# Altium project Lab1_Kondrashova_USB_RS485.PrjPcb
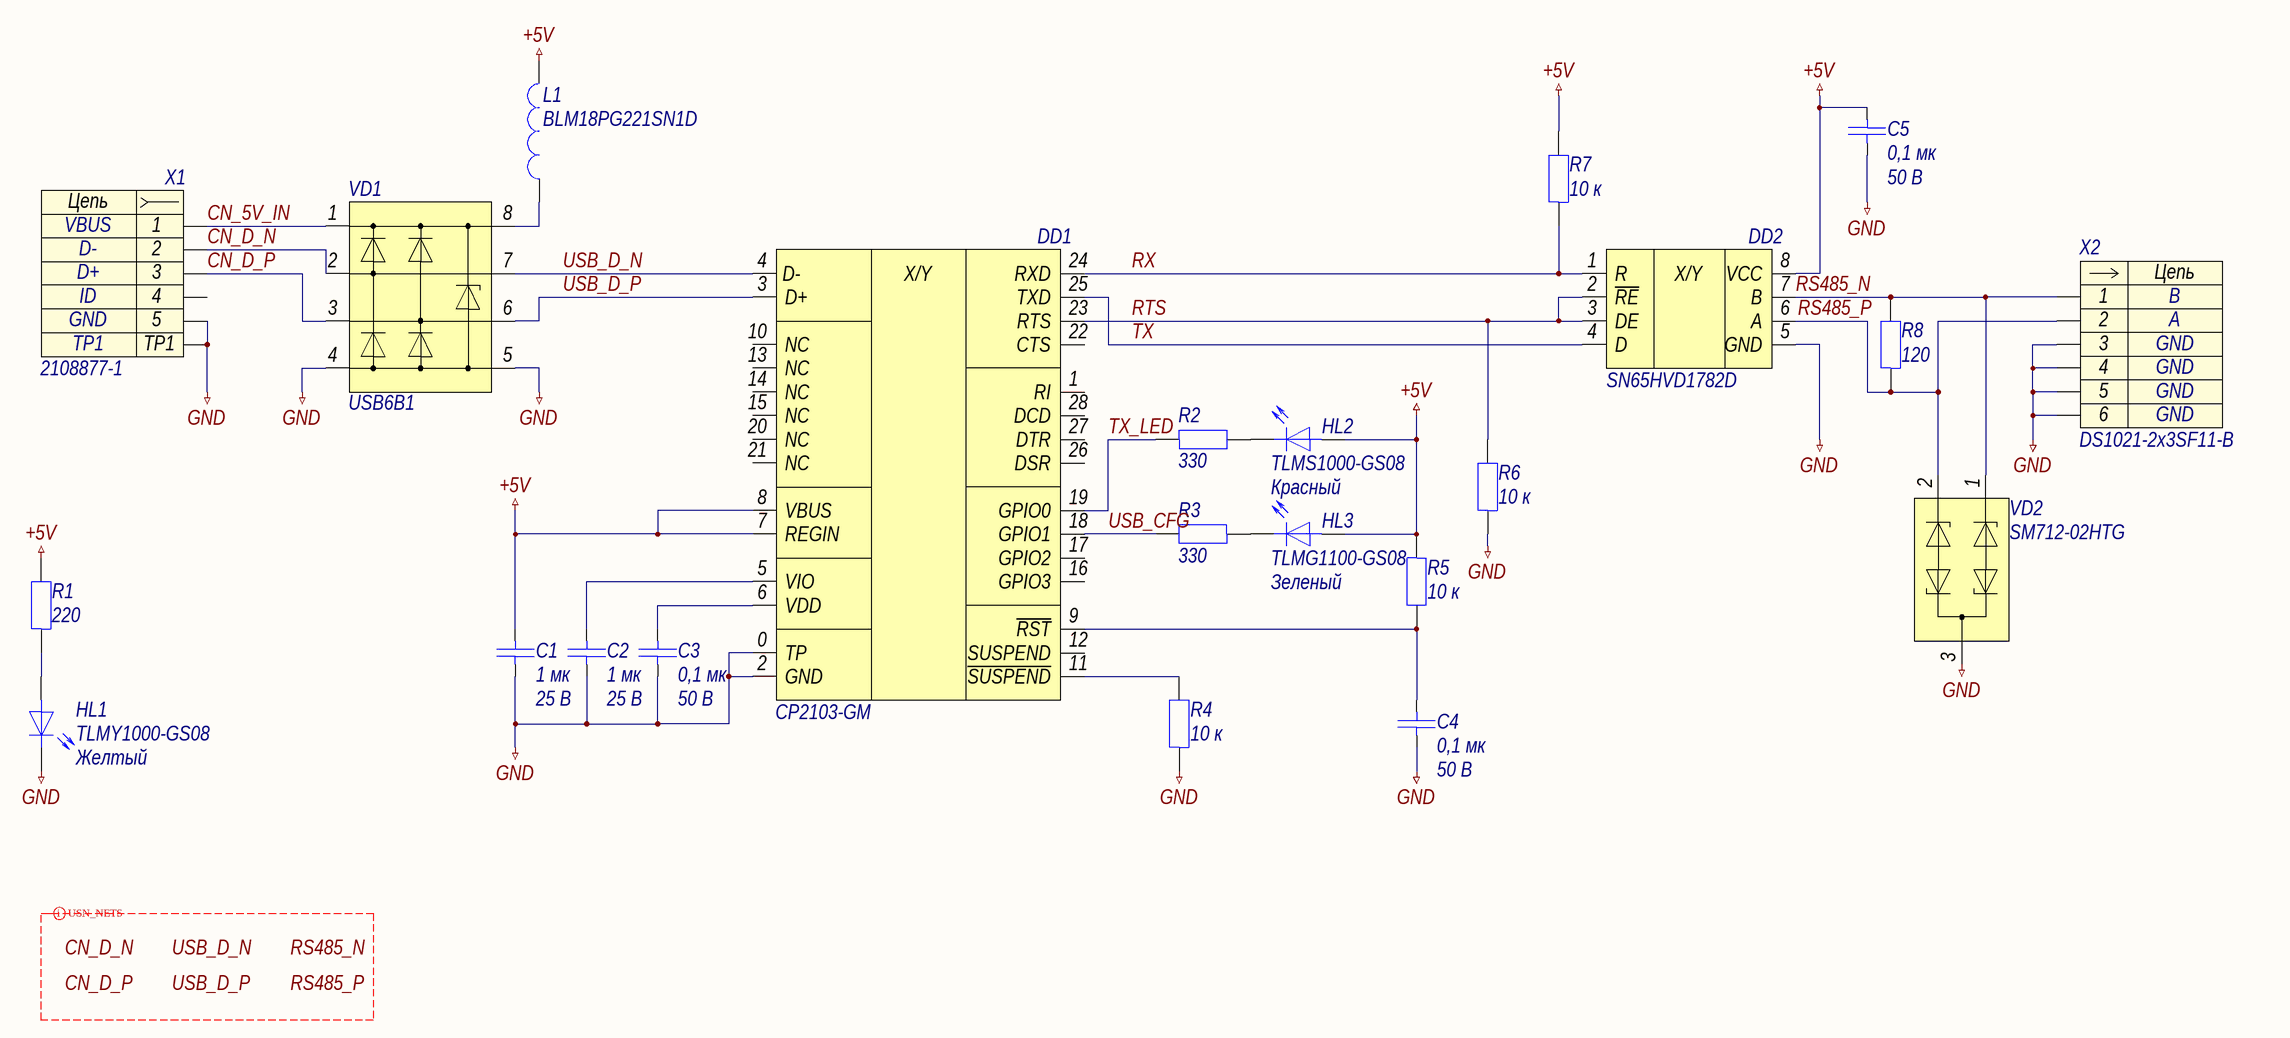
[diagram p0: Lab1_Kondrashova_USB_RS485.SchDoc]
approver: Капустин; check: Капустин; designation: СПбПУ.3331506.012; developer: Кондрашова; document_code: Ý3; document_type: Схема электрическая принципиальная; pcb_dec_number: СПбПУ.3331506.012; project: Лабораторная работа 1; sheets_total: 1; title: Преобразователь интерфейсов; title_line_1: Преобразователь; title_line_2: USB-RS485
1 sheet, 23 parts. Net scope: global (net labels, ports and power ports of the same name join across sheets).
Board file: Lab1_Kondrashova_USB_RS485.PcbDoc

## Sheet Lab1_Kondrashova_USB_RS485.SchDoc: Преобразователь интерфейсов
size 594 x 420 mm; ApprovedBy: Капустин; CheckedBy: Капустин; DrawnBy: Кондрашова; DocumentNumber: СПбПУ.3331506.012Ý3; SheetNumber: 1; SheetTotal: 1; DocumentCode: Ý3; ImagePath: СПбПУ.3331506.012

### Parts
C1  1 мк  Напряжение: 25 В  [C0603]
C2  1 мк  Напряжение: 25 В  [C0603]
C3  0,1 мк  Напряжение: 50 В  [C0603]
C4  0,1 мк  Напряжение: 50 В  [C0603]
C5  0,1 мк  Напряжение: 50 В  [C0603]
DD1  CP2103-GM  [QFN-28-500X500X90]
DD2  SN65HVD1782D  [SOIC-8]
HL1  TLMY1000-GS08  Colour: Желтый  [HL0603]
HL2  TLMS1000-GS08  Colour: Красный  [HL0603]
HL3  TLMG1100-GS08  Colour: Зеленый  [HL0603]
L1  BLM18PG221SN1D  [BLM-2-0603]
R1  220  [R0603]
R2  330  [R0603]
R3  330  [R0603]
R4  10 к  [R0603]
R5  10 к  [R0603]
R6  10 к  [R0603]
R7  10 к  [R0603]
R8  120  [R0603]
VD1  USB6B1  [SO-8]
VD2  SM712-02HTG  [SOT23-3]
X1  2108877-1  [2108877-1]
X2  DS1021-2x3SF11-B  [DS1021-2X3SF11-B]

### Nets
+5V: C1.1 C5.2 DD1.7(REGIN) DD1.8(VBUS) DD2.8(VCC) HL2.2 HL3.2 L1.2 R1.2 R5.1 R7.2
GND: C1.2 C2.2 C3.2 C4.2 C5.1 DD1.0(TP) DD1.2(GND) DD2.5(GND) HL1.1 R4.1 R6.1 VD1.4 VD1.5 VD2.3 X1.5 X1.TP1 X2.3 X2.4 X2.5 X2.6
CN_5V_IN: VD1.1 X1.1
CN_D_N: VD1.2 X1.2
CN_D_P: VD1.3 X1.3
RS485_N: DD2.7(B) R8.2 VD2.1 X2.1
RS485_P: DD2.6(A) R8.1 VD2.2 X2.2
RTS: DD1.23(RTS) DD2.2(~{RE}) DD2.3(DE) R6.2
RX: DD1.24(RXD) DD2.1(R) R7.1
TX: DD1.25(TXD) DD2.4(D)
TX_LED: DD1.19(GPIO0) R2.1
USB_CFG: DD1.18(GPIO1) R3.2
USB_D_N: DD1.4(D-) VD1.7
USB_D_P: DD1.3(D+) VD1.6
NetC2_1: C2.1 DD1.5(VIO)
NetC3_1: C3.1 DD1.6(VDD)
NetC4_1: C4.1 DD1.9(~{RST}) R5.2
NetDD1_11: DD1.11(~{SUSPEND}) R4.2
NetHL1_2: HL1.2 R1.1
NetHL2_1: HL2.1 R2.2
NetHL3_1: HL3.1 R3.1
NetL1_1: L1.1 VD1.8

Not connected (* = marked no-connect by the designer): DD1 1(RI) 10(NC) 12(SUSPEND) 13(NC) 14(NC) 15(NC) 16(GPIO3) 17(GPIO2) 20(NC) 21(NC) 22(CTS) 26(DSR) 27(DTR) 28(DCD); X1 4

### Layout directives
differential pair; rule Differential Pairs Routing [Pref Gap = 0.15mm    Min Gap  = 0.15mm    Max Gap  = 0.15mmPref Width = 0.125mm    Min Width  = 0.125mm    Max Width  = 0.125mm]; differential pair class USB_SIGNALS: CN_D_N, CN_D_P, RS485_N, RS485_P, USB_D_N, USB_D_P

### Notes on the sheet
- Labels drawn without touching a wire or pin: CN_D_N, CN_D_P, RS485_N, RS485_P, USB_D_N, USB_D_P
- Перв. примен.
- Справ. №
- Подп. и дата
- Инв. № дубл.
- Нормоконтроль:
- Взам. инв. №
- Изм.
- Лист
- № докум.
- Подп.
- Дата
- Лит.
- Масса
- Масштаб
- Т.контр.
- Пров.
- Разраб.
- Листов
- Разработал:
- Инв. № подл.
- Н.контр.
- Утв.
- Копировал
- Формат
- А2
- (in symbol dd0004) X/Y
- (in symbol dd0014) X/Y
- (in symbol x0001) Цепь
- (in symbol x0015) Цепь

### Library data of the parts
C1 C2 = c0008: =Описание; ID: c0008; Фамилия: Ларионов; Описание: Конденсатор чип 0603 1 мкФ 25 В ±10 %; Наименование: CC0603KRX7R8BB105; Производитель: Yageo; Отклонение: ±10 %; Рабочие температуры: от -55 °С до +125 °С; Корпус: 0603; Номинал: 1 мк; Номинальное напряжение: 25 В; HelpURL: https://www.yageo.com/upload/media/product/products/datasheet/mlcc/UPY-GPHC_X7R_6.3V-to-50V_20.pdf
C3-C5 = c0005: =Описание; ID: c0005; Фамилия: Ларионов; Описание: Конденсатор чип 0603 0,1 мкФ 50 В ±5 %; Наименование: CC0603JRX7R9BB104; Производитель: Yageo; Отклонение: ±5 %; Рабочие температуры: от -55 °С до +125 °С; Корпус: 0603; Номинал: 0,1 мк; Номинальное напряжение: 50 В; HelpURL: https://www.yageo.com/upload/media/product/products/datasheet/mlcc/UPY-GPHC_X7R_6.3V-to-50V_20.pdf
DD1 = dd0004: =Описание; ID: dd0004; Фамилия: Кондрашова; Описание: Преобразователь USB-UART; Производитель: Silicon Laboratories; Корпус: QFN-28; Наименование: CP2103-GM; HelpURL: https://www.silabs.com/interface/usb-bridges/classic/device.cp2103
DD2 = dd0014: =Описание; ID: dd0014; Фамилия: Кондрашова; Описание: Приемопередатчик RS-485; Производитель: Texas Instruments; Наименование: SN65HVD1782D; Корпус: SOIC-8; HelpURL: https://www.ti.com/product/SN65HVD1782
HL1 = hl0003: =Описание; ID: hl0003; Фамилия: Ларионов; Описание: Светодиод чип 0603 желтый; Производитель: Vishay Intertechnology, Inc.; Номинальная сила света: 7,5 мкд; Номинальная длина волны: 588 нм; Номинальный прямой ток: 15 мА; Номинальное падение напряжения: 1,8 В; Рассеиваемая мощность: 40 мВт; Рабочие температуры: от –40 °С до +100 °С; Корпус: 0603; Наименование: TLMY1000-GS08; Цвет: Желтый; HelpURL: https://www.vishay.com/leds/list/product-83172/
HL2 = hl0001: =Описание; ID: hl0001; Фамилия: Ларионов; Описание: Светодиод чип 0603 красный; Производитель: Vishay Intertechnology, Inc.; Номинальная сила света: 4 мкд; Номинальная длина волны: 628 нм; Номинальный прямой ток: 15 мА; Номинальное падение напряжения: 1,8 В; Рассеиваемая мощность: 40 мВт; Рабочие температуры: от –40 °С до +100 °С; Корпус: 0603; Наименование: TLMS1000-GS08; Цвет: Красный; HelpURL: https://www.vishay.com/leds/list/product-83172/
HL3 = hl0005: =Описание; ID: hl0005; Фамилия: Ларионов; Описание: Светодиод чип 0603 зеленый; Производитель: Vishay Intertechnology, Inc.; Номинальная сила света: 35 мкд; Номинальная длина волны: 570 нм; Номинальный прямой ток: 30 мА; Номинальное падение напряжения: 2,1 В; Рассеиваемая мощность: 90 мВт; Рабочие температуры: от –40 °С до +100 °С; Корпус: 0603; Наименование: TLMG1100-GS08; Цвет: Зеленый; HelpURL: https://www.vishay.com/leds/list/product-83173/
L1 = l0002: =Описание; ID: l0002; Фамилия: Самарин; Описание: Ферритовая бусина 220 Ом ±25 %; Производитель: Murata Manufacturing Co., Ltd.; Сопротивление, 100 МГц: 220 Ом; Отклонение, 100 Мгц: ±25 %; Сопротивление при постоянном токе: 0,1 Ом; Рабочие температуры: от -55 °С до +125 °С; Корпус: 0603; Наименование: BLM18PG221SN1D; HelpURL: https://www.murata.com/en-global/products/productdetail?partno=BLM18PG221SN1%23
R1 = r0008: =Описание; ID: r0008; Фамилия: Ларионов; Описание: Резистор чип 0603 220 Ом ±1 % 0,1 Вт; Наименование: RC0603FR-07220RL; Производитель: Yageo; Отклонение: ±1 %; Номинальное напряжение: 75 В; Рабочие температуры: от -55 °С до +155 °С; Номинальный ток: 1 А; Корпус: 0603; Номинал: 220; HelpURL: https://www.yageo.com/upload/media/product/productsearch/datasheet/rchip/PYu-RC_Group_51_RoHS_L_11.pdf
R2 R3 = r0005: =Описание; ID: r0005; Фамилия: Ларионов; Описание: Резистор чип 0603 330 Ом ±1 % 0,1 Вт; Наименование: RC0603FR-07330RL; Производитель: Yageo; Отклонение: ±1 %; Номинальное напряжение: 75 В; Рабочие температуры: от -55 °С до +155 °С; Номинальный ток: 1 А; Корпус: 0603; Номинал: 330; HelpURL: https://www.yageo.com/upload/media/product/productsearch/datasheet/rchip/PYu-RC_Group_51_RoHS_L_11.pdf
R4-R7 = r0012: =Описание; ID: r0012; Фамилия: Самарин; Описание: Резистор чип 0603 10 кОм ±1 % 0,1 Вт; Наименование: RC0603FR-0710KL; Производитель: Yageo; Отклонение: ±1 %; Номинальное напряжение: 75 В; Рабочие температуры: от -55 °С до +155 °С; Номинальный ток: 1 А; Корпус: 0603; Номинал: 10 к; HelpURL: https://www.yageo.com/upload/media/product/productsearch/datasheet/rchip/PYu-RC_Group_51_RoHS_L_11.pdf
R8 = r0007: =Описание; ID: r0007; Фамилия: Самарин; Описание: Резистор чип 0603 120 Ом ±1 % 0,1 Вт; Наименование: RC0603FR‍‐07120RL; Производитель: Yageo; Отклонение: ±1 %; Номинальное напряжение: 75 В; Рабочие температуры: от -55 °С до +155 °С; Номинальный ток: 1 А; Корпус: 0603; Номинал: 120; HelpURL: https://www.yageo.com/upload/media/product/productsearch/datasheet/rchip/PYu-RC_Group_51_RoHS_L_11.pdf
VD1 = vd0005: =Описание; ID: vd0005; Фамилия: Ларионов; Описание: Диодная сборка для подавления помех, от 6 В; Производитель: STMicroelectronics; Наименование: USB6B1; Корпус: SO-8; HelpURL: https://www.st.com/content/st_com/en/products/protection-devices/esd-protection/usb-port-protection/usb6b1.html
VD2 = vd0003: =Описание; ID: vd0003; Фамилия: Самарин; Описание: Диодная сборка для подавления помех, -7/12 В; Производитель: Littelfuse, Inc.; Наименование: SM712-02HTG; Корпус: SOT23-3; HelpURL: https://www.littelfuse.com/products/tvs-diode-arrays/general-purpose-esd-protection/sm712.aspx
X1 = x0001: =Описание; Contact_1: VBUS; Contact_2: D-; Contact_3: D+; Contact_4: ID; Contact_5: GND; ID: x0001; Фамилия: Ларионов; Описание: Micro USB Type B IP68 гнездо; Производитель: TE Connectivity; Наименование: 2108877-1; HelpURL: https://www.te.com/global-en/product-2108877-1.html
X2 = x0015: =Описание; Contact_1: B; Contact_2: A; Contact_3: GND; ID: x0015; Фамилия: Самарин; Описание: PLS 2x3 pin 2,54 мм вилка прямой; Производитель: Connfly Electronic Co., Ltd.; Contact_4: GND; Contact_5: GND; Contact_6: GND; Наименование: DS1021-2x3SF11-B; HelpURL: http://en.connfly.group/product/xVkr=EusQssAN0gN=Aos=mU+UrVkR9kqEAN0gN9g+WqANB+A